# Altium schematic sheet Another_flashlight.SchDoc
size A
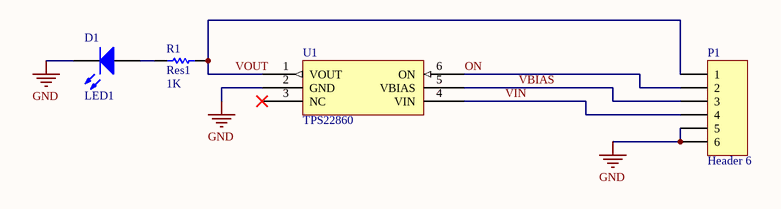
[diagram p0: Another_flashlight.SchDoc]

## Parts
D1  LED1  [LED-1]
P1  Header 6  [HDR1X6]
R1  Res1  value 1K  [AXIAL-0.3]
U1  TPS22860  [TSOP95P280X145-6N]

## Nets
GND: D1.2(K) P1.5 P1.6 U1.2(GND)
ON: P1.2 U1.6(ON)
VBIAS: P1.3 U1.5(VBIAS)
VIN: P1.4 U1.4(VIN)
VOUT: P1.1 R1.2 U1.1(VOUT)
NetD1_1: D1.1(A) R1.1

Not connected (* = marked no-connect by the designer): U1 3(NC)*

## Library data of the parts
D1 = LED1: Typical RED GaAs LED; Published: 8-Jun-2000; LatestRevisionDate: 08-Jul-2005; LatestRevisionNote: Mech Layer 1 removed.; PackageReference: LED-1; Publisher: Altium Limited; PackageDescription: LED; 2 Leads
P1 = Header 6: Header, 6-Pin; LatestRevisionDate: 17-Jul-2002; LatestRevisionNote: Re-released for DXP Platform.; Publisher: Altium Limited
R1 = Res1: Resistor; Published: 8-Jun-2000; LatestRevisionDate: 17-Jul-2002; LatestRevisionNote: Re-released for DXP Platform.; PackageReference: AXIAL-0.3; Publisher: Altium Limited; PackageDescription: Axial Device, Thru-Hole; 2 Leads; 0.3 in Pin Spacing